# Altium schematic sheet power.SchDoc
size A4; SheetNumber: 1; SheetTotal: 2
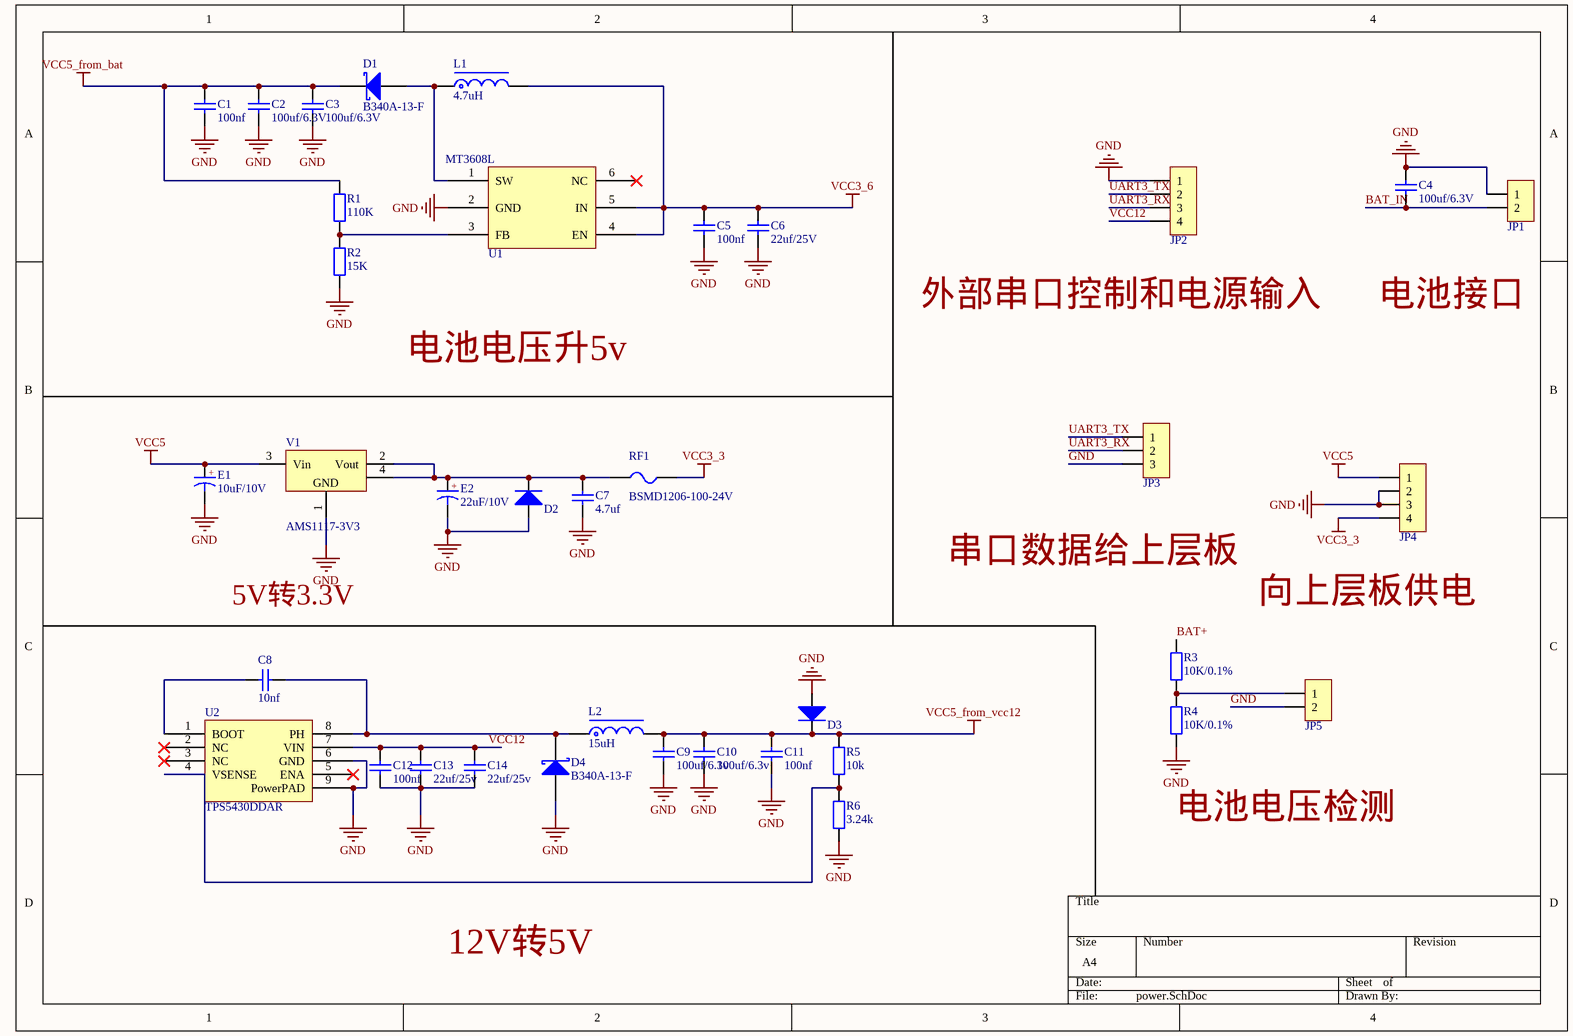
[diagram p0: power.SchDoc]

## Parts
C1  100nf  [C0603_L]
C2  100uf/6.3V  [C1206_L]
C3  100uf/6.3V  [C1206_L]
C4  100uf/6.3V  [C1206_L]
C5  100nf  [C0603_L]
C6  22uf/25V  [C1206_L]
C7  4.7uf  [C0603_M]
C8  10nf  [C0603_L]
C9  100uf/6.3v  [C1206_L]
C10  100uf/6.3v  [C1206_L]
C11  100nf  [C0603_L]
C12  100nf  [C0603_L]
C13  22uf/25v  [C1206_L]
C14  22uf/25v  [C1206_L]
D1  B340A-13-F  [SMA]
D2  UDD32C03L01  [SOD-323]  (value not drawn)
D3  SMF5.0A  [SOD-123]  (value not drawn)
D4  B340A-13-F  [SMA]
E1  10uF/10V  [C_3216]
E2  22uF/10V  [C_3216]
JP1  HDR-1X2  [PH2.0-W-2P]  (value not drawn)
JP2  HDR-1X4  [PH2.0-W-4P]  (value not drawn)
JP3  HDR-1X3  [HDR2.54-LI-3P]  (value not drawn)
JP4  HDR-1X4  [HDR2.54-LI-4P]  (value not drawn)
JP5  HDR-1X2  [HDR2.54-LI-2P]  (value not drawn)
L1  4.7uH  [CD53]
L2  15uH  [CD75]
R1  110K  [R0603_L]
R2  15K  [R0603_L]
R3  10K/0.1%  [R0603_L]
R4  10K/0.1%  [R0603_L]
R5  10k  [R0603_L]
R6  3.24k  [R0603_L]
RF1  BSMD1206-100-24V  [F1206]
U1  MT3608L  [SOT23-6M]
U2  TPS5430DDAR  [SOIC-8_EP]
V1  AMS1117-3V3  [SOT223_L]

## Nets
GND: C1.1 C2.1 C3.1 C4.2 C5.1 C6.1 C7.2 C9.1 C10.1 C11.1 C12.1 C13.1 C14.1 D2.1(A) D3.1(A) D4.1(A) E1.2(K) E2.2(K) JP1.1 JP2.1 JP3.3 JP4.2 JP4.3 JP5.2 R2.1 R4.1 R6.1 U1.2(GND) U2.6(GND) U2.9(PowerPAD) V1.1(GND)
VCC3_3: JP4.4 RF1.1
VCC3_6: C5.2 C6.2 L1.2 U1.4(EN) U1.5(IN)
VCC5: E1.1(A) JP4.1 V1.3(Vin)
VCC5_from_bat: C1.2 C2.2 C3.2 D1.2(K) R1.2
VCC5_from_vcc12: C9.2 C10.2 C11.2 D3.2(K) L2.2 R5.2
BAT+: R3.2
BAT_IN: C4.1 JP1.2
UART3_RX: JP2.3 JP3.2
UART3_TX: JP2.2 JP3.1
VCC12: C12.2 C13.2 C14.2 JP2.4 U2.7(VIN)
NetC7_1: C7.1 D2.2(K) E2.1(A) RF1.2 V1.2(Vout) V1.4(GND)
NetC8_1: C8.1 U2.1(BOOT)
NetC8_2: C8.2 D4.2(K) L2.1 U2.8(PH)
NetD1_1: D1.1(A) L1.1 U1.1(SW)
NetJP5_1: JP5.1 R3.1 R4.2
NetR1_1: R1.1 R2.2 U1.3(FB)
NetR5_1: R5.1 R6.2 U2.4(VSENSE)

Not connected (* = marked no-connect by the designer): U1 6(NC)*; U2 2(NC)* 3(NC)* 5(ENA)*

## Notes on the sheet
- 外部串口控制和电源输入
- 电池接口
- 电池电压升5v
- 串口数据给上层板
- 5V转3.3V
- 向上层板供电
- 电池电压检测
- 12V转5V
- (in symbol CT) +

## Library data of the parts
C1-C6 = C: 贴片电容/MLCC电容; BOM名称: 无极性贴片电容
  C2-C4: jlc_id: C15008
C7 C8 C11-C13 = C: 贴片电容/MLCC电容; BOM名称: 无极性贴片电容; 联系下单店铺卖家 免费帮你查找封装: 联系下单店铺卖家 免费技术指导
C9 C10 = C: 贴片电容/MLCC电容 C15008; BOM名称: 无极性贴片电容; 联系下单店铺卖家 免费帮你查找封装: 联系下单店铺卖家 免费技术指导
C14 = C: 贴片电容/MLCC电容 C12891; BOM名称: 无极性贴片电容; 联系下单店铺卖家 免费帮你查找封装: 联系下单店铺卖家 免费技术指导
D1 = B340A-13-F: 肖特基二极管 C85098; 属性: 60V/5A; BOM名称: 肖特基二极管
D2 = TVS: TVS通用 C78439; 当前库版本V2024.3.30 @淘宝卖家:黄晶宝石: 最新版本发布https://item.taobao.com/item.htm?id=566775463719
D3 = TVS: TVS通用; 当前库版本V2024.3.30 @淘宝卖家:黄晶宝石: 最新版本发布https://item.taobao.com/item.htm?id=566775463719
D4 = B340A-13-F: 肖特基二极管 C85098; 属性: 60V/5A; 当前库版本V2024.3.30 @淘宝卖家:黄晶宝石: 最新版本发布https://item.taobao.com/item.htm?id=566775463719; BOM名称: 肖特基二极管
E1 = CT: 贴片钽电容 C7171; 联系下单店铺卖家 免费帮你查找封装: 联系下单店铺卖家 免费技术指导; BOM名称: 贴片钽电容
E2 = CT: 贴片钽电容  C11366; 联系下单店铺卖家 免费帮你查找封装: 联系下单店铺卖家 免费技术指导; BOM名称: 贴片钽电容
JP1 = Header 2: 2P接插件; 封装库来自淘宝卖家：黄晶宝石: 获取最新版本https://shop463601444.taobao.com; 联系下单店铺卖家 免费帮你查找封装: 联系下单店铺卖家 免费技术支持; BOM名称: 2P接插件
JP2 = Header 4: 4P接插件; 封装库来自淘宝卖家：黄晶宝石: 获取最新版本https://shop463601444.taobao.com; 联系下单店铺卖家 免费帮你查找封装: 联系下单店铺卖家 免费技术支持
JP3 = Header 3: 3P接插件; 联系卖家，免费查找封装: 唯一出售店铺网址https://shop463601444.taobao.com; 封装库来自淘宝卖家ID：黄晶宝石: 其他店铺购入均为盗版封装库，请立即申请退款，本店现金奖励50~200元; BOM名称: 3P接插件
JP4 = Header 4: 4P接插件; 联系卖家，免费查找封装: 唯一出售店铺网址https://shop463601444.taobao.com; 封装库来自淘宝卖家ID：黄晶宝石: 其他店铺购入均为盗版封装库，请立即申请退款，本店现金奖励50~200元; BOM名称: 4P接插件
JP5 = Header 2: 2P接插件; 联系卖家，免费查找封装: 唯一出售店铺网址https://shop463601444.taobao.com; 封装库来自淘宝卖家ID：黄晶宝石: 其他店铺购入均为盗版封装库，请立即申请退款，本店现金奖励50~200元; BOM名称: 2P接插件
L1 L2 = L-SMD: CD系列贴片线绕功率电感; BOM名称: 功率电感
  L1: jlc_id: C177246
  L2: jlc_id: C177243
R1-R6 = R: 贴片电阻; 联系下单店铺卖家 免费帮你查找封装: 联系下单店铺卖家 免费技术指导; BOM名称: 贴片电阻
RF1 = FUSE-PPTC: PPTC自恢复保险丝 C910830; 当前库版本V2024.3.30 @淘宝卖家:黄晶宝石: 最新版本发布https://item.taobao.com/item.htm?id=566775463719; BOM名称: PPTC自恢复保险丝
U1 = MT3608L: Boost升压DC-DC芯片 2-28V
U2 = TPS5430DDAR: 5.5v到36v转1.3v到32v
V1 = AMS1117: 三端稳压芯片; BOM名称: 稳压芯片; 联系下单店铺卖家 免费帮你查找封装: 联系下单店铺卖家 免费技术支持; 当前库版本V2024.3.30 @淘宝卖家:黄晶宝石: 最新版本发布https://item.taobao.com/item.htm?id=566775463719